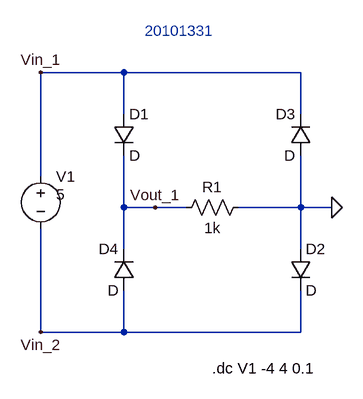
[diagram p0: schematic Full wave rectifier.asc]
Full wave rectifier.asc, the LTspice schematic file:
Version 4
SHEET 1 880 680
WIRE 192 -32 64 -32
WIRE 464 -32 192 -32
WIRE 192 32 192 -32
WIRE 464 32 464 -32
WIRE 64 128 64 -32
WIRE 192 176 192 96
WIRE 240 176 192 176
WIRE 288 176 240 176
WIRE 464 176 464 96
WIRE 464 176 368 176
WIRE 512 176 464 176
WIRE 192 240 192 176
WIRE 464 240 464 176
WIRE 64 368 64 208
WIRE 192 368 192 304
WIRE 192 368 64 368
WIRE 464 368 464 304
WIRE 464 368 192 368
FLAG 64 -32 Vin_1
FLAG 512 176 0
FLAG 64 368 Vin_2
FLAG 240 176 Vout_1
SYMBOL voltage 64 112 R0
WINDOW 3 24 44 Left 2
WINDOW 123 0 0 Left 0
WINDOW 39 0 0 Left 0
SYMATTR InstName V1
SYMATTR Value 5
SYMBOL diode 176 32 R0
SYMATTR InstName D1
SYMBOL diode 448 240 R0
SYMATTR InstName D2
SYMBOL diode 480 96 R180
WINDOW 0 24 64 Left 2
WINDOW 3 24 0 Left 2
SYMATTR InstName D3
SYMBOL diode 208 304 R180
WINDOW 0 24 64 Left 2
WINDOW 3 24 0 Left 2
SYMATTR InstName D4
SYMBOL res 384 160 R90
WINDOW 0 0 56 VBottom 2
WINDOW 3 32 56 VTop 2
SYMATTR InstName R1
SYMATTR Value 1k
TEXT 224 -96 Left 2 ;20101331
TEXT 328 424 Left 2 !.dc V1 -4 4 0.1

The netlist it stands for:
* Full wave rectifier.asc
V1 Vin_1 Vin_2 5
D1 Vin_1 Vout_1 D
D2 0 Vin_2 D
D3 0 Vin_1 D
D4 Vin_2 Vout_1 D
R1 0 Vout_1 1k
.model D D
.lib standard.dio
* 20101331
.dc V1 -4 4 0.1
.backanno
.end